# EAGLE design Wiegand (EAGLE 6.3)
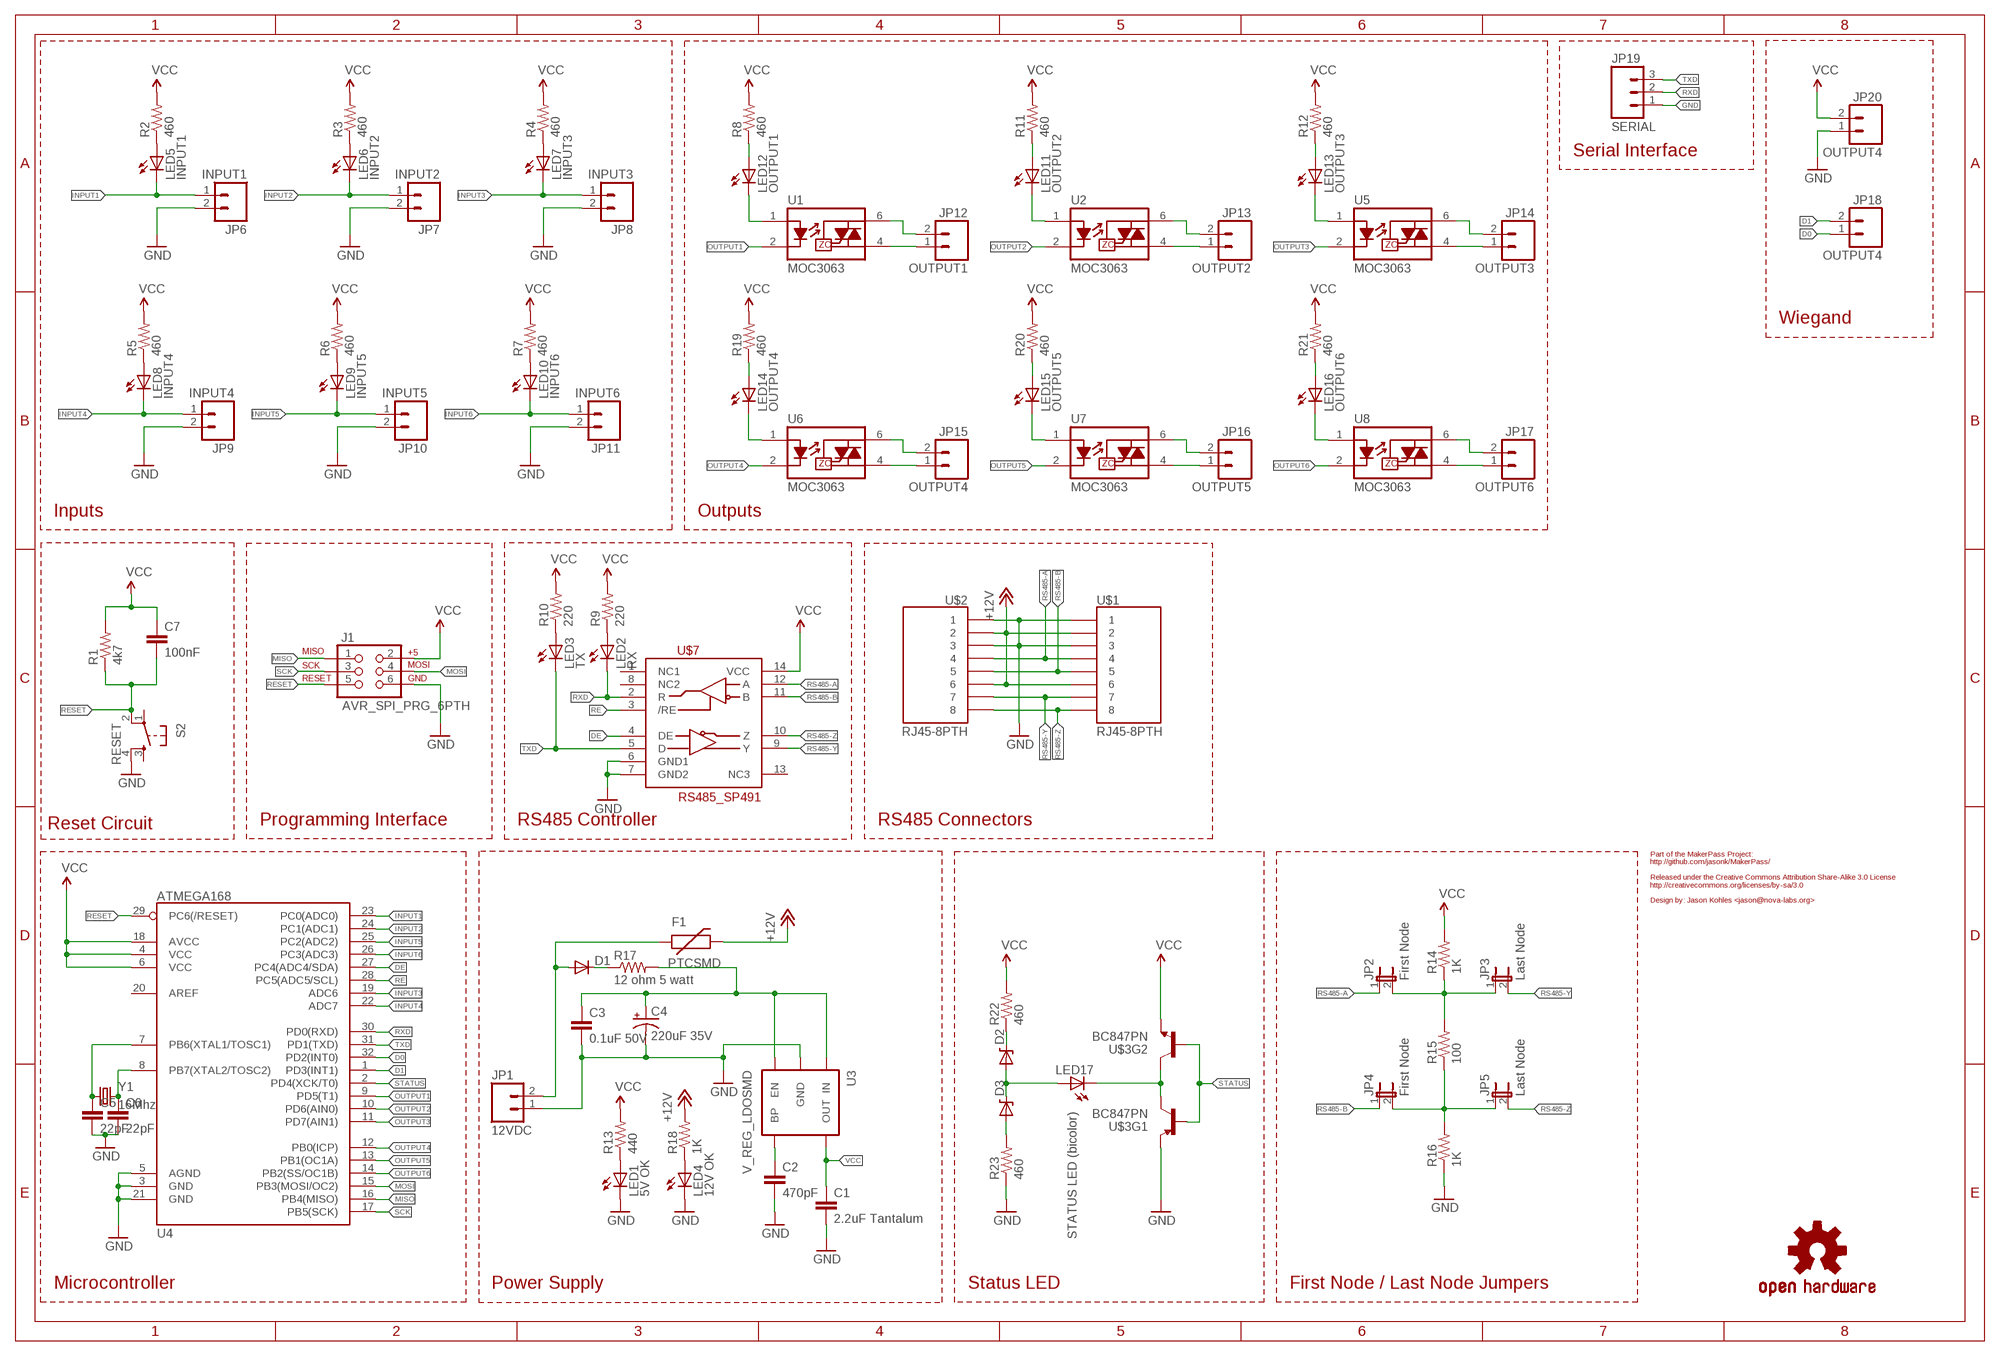
[diagram p0: schematic, sheet 1]

## Parts
C1  2.2uF Tantalum  CAP0402-CAP  [0402-CAP]
C2  470pF  CAP0402-CAP  [0402-CAP]
C3  0.1uF 50V  CAP0402-CAP  [0402-CAP]
C4  220uF 35V  CAP_POLSMD  [VISHAY_C]
C5  22pF  CAP0603-CAP  [0603-CAP]
C6  22pF  CAP0603-CAP  [0603-CAP]
C7  100nF  CAP0603-CAP  [0603-CAP]
D1  DIODESMA  [SMA-DIODE]
D2  DIODE-ZENER-BZT52  [SOD-323]
D3  DIODE-ZENER-BZT52  [SOD-323]
F1  PTCSMD  [PTC-1206]
J1  AVR_SPI_PRG_6PTH  [2X3]
JP1  12VDC  M025MM  [SCREWTERMINAL-5MM-2]
JP2  First Node  JUMPER-2PTH  [1X02]
JP3  Last Node  JUMPER-2PTH  [1X02]
JP4  First Node  JUMPER-2PTH  [1X02]
JP5  Last Node  JUMPER-2PTH  [1X02]
JP6  INPUT1  M023.5MM  [SCREWTERMINAL-3.5MM-2]
JP7  INPUT2  M023.5MM  [SCREWTERMINAL-3.5MM-2]
JP8  INPUT3  M023.5MM  [SCREWTERMINAL-3.5MM-2]
JP9  INPUT4  M023.5MM  [SCREWTERMINAL-3.5MM-2]
JP10  INPUT5  M023.5MM  [SCREWTERMINAL-3.5MM-2]
JP11  INPUT6  M023.5MM  [SCREWTERMINAL-3.5MM-2]
JP12  OUTPUT1  M023.5MM  [SCREWTERMINAL-3.5MM-2]
JP13  OUTPUT2  M023.5MM  [SCREWTERMINAL-3.5MM-2]
JP14  OUTPUT3  M023.5MM  [SCREWTERMINAL-3.5MM-2]
JP15  OUTPUT4  M023.5MM  [SCREWTERMINAL-3.5MM-2]
JP16  OUTPUT5  M023.5MM  [SCREWTERMINAL-3.5MM-2]
JP17  OUTPUT6  M023.5MM  [SCREWTERMINAL-3.5MM-2]
JP18  OUTPUT4  M023.5MM  [SCREWTERMINAL-3.5MM-2]
JP19  SERIAL  M03PTH  [1X03]
JP20  OUTPUT4  M023.5MM  [SCREWTERMINAL-3.5MM-2]
LED1  5V OK  LED1206  [LED-1206]
LED2  RX  LED1206  [LED-1206]
LED3  TX  LED1206  [LED-1206]
LED4  12V OK  LED1206  [LED-1206]
LED5  INPUT1  LED1206  [LED-1206]
LED6  INPUT2  LED1206  [LED-1206]
LED7  INPUT3  LED1206  [LED-1206]
LED8  INPUT4  LED1206  [LED-1206]
LED9  INPUT5  LED1206  [LED-1206]
LED10  INPUT6  LED1206  [LED-1206]
LED11  OUTPUT2  LED1206  [LED-1206]
LED12  OUTPUT1  LED1206  [LED-1206]
LED13  OUTPUT3  LED1206  [LED-1206]
LED14  OUTPUT4  LED1206  [LED-1206]
LED15  OUTPUT5  LED1206  [LED-1206]
LED16  OUTPUT6  LED1206  [LED-1206]
LED17  STATUS LED (bicolor)  LED1206  [LED-1206]
LOGO1  OSHW-LOGOM  [OSHW-LOGO-M]
R1  4k7  RESISTOR0603-RES  [0603-RES]
R2  460  RESISTOR0603-RES  [0603-RES]
R3  460  RESISTOR0603-RES  [0603-RES]
R4  460  RESISTOR0603-RES  [0603-RES]
R5  460  RESISTOR0603-RES  [0603-RES]
R6  460  RESISTOR0603-RES  [0603-RES]
R7  460  RESISTOR0603-RES  [0603-RES]
R8  460  RESISTOR0603-RES  [0603-RES]
R9  220  RESISTOR0603-RES  [0603-RES]
R10  220  RESISTOR0603-RES  [0603-RES]
R11  460  RESISTOR0603-RES  [0603-RES]
R12  460  RESISTOR0603-RES  [0603-RES]
R13  440  RESISTOR0603-RES  [0603-RES]
R14  1K  RESISTOR0603-RES  [0603-RES]
R15  100  RESISTOR0603-RES  [0603-RES]
R16  1K  RESISTOR0603-RES  [0603-RES]
R17  12 ohm 5 watt  RESISTOR0603-RES  [0603-RES]
R18  1K  RESISTOR0603-RES  [0603-RES]
R19  460  RESISTOR0603-RES  [0603-RES]
R20  460  RESISTOR0603-RES  [0603-RES]
R21  460  RESISTOR0603-RES  [0603-RES]
R22  460  RESISTOR0603-RES  [0603-RES]
R23  460  RESISTOR0603-RES  [0603-RES]
S2  RESET  TAC_SWITCHSMD  [TACTILE_SWITCH_SMD]
U1  MOC3063  MOC3063S  [DIP8SMD]
U2  MOC3063  MOC3063S  [DIP8SMD]
U3  V_REG_LDOSMD  [SOT23-5]
U4  ATMEGA168  [TQFP32-08]
U5  MOC3063  MOC3063S  [DIP8SMD]
U6  MOC3063  MOC3063S  [DIP8SMD]
U7  MOC3063  MOC3063S  [DIP8SMD]
U8  MOC3063  MOC3063S  [DIP8SMD]
U$1  RJ45-8PTH  [RJ45-8]
U$2  RJ45-8PTH  [RJ45-8]
U$3  BC847PN  [SOT363]
U$7  RS485_SP491  [SOIC-14]
Y1  16Mhz  CRYSTALSMD  [HC49UP]

## Nets
12V_IN [power]: D1.A F1.1 JP1.2
+12V [power]: F1.2 R18.2 U$1.2 U$1.6 U$2.2 U$2.6
D0: JP18.1 U4.32(PD2(INT0))
D1: JP18.2 U4.1(PD3(INT1))
DE: U4.27(PC4(ADC4/SDA)) U$7.4(DE)
GND: C1.2 C2.2 C3.2 C4.- C5.2 C6.2 J1.6 JP1.1 JP6.2 JP7.2 JP8.2 JP9.2 JP10.2 JP11.2 JP19.1 JP20.1 LED1.C LED4.C R16.1 R23.1 S2.4 U3.2(GND) U4.3(GND) U4.5(AGND) U4.21(GND) U$1.1 U$1.3 U$2.1 U$2.3 U$3.1(E) U$7.6(GND1) U$7.7(GND2)
INPUT1: JP6.1 LED5.C U4.23(PC0(ADC0))
INPUT2: JP7.1 LED6.C U4.24(PC1(ADC1))
INPUT3: JP8.1 LED7.C U4.19(ADC6)
INPUT4: JP9.1 LED8.C U4.22(ADC7)
INPUT5: JP10.1 LED9.C U4.25(PC2(ADC2))
INPUT6: JP11.1 LED10.C U4.26(PC3(ADC3))
MISO: J1.1 U4.16(PB4(MISO))
MOSI: J1.4 U4.15(PB3(MOSI/OC2))
N$1: LED1.A R13.1
N$3: C2.1 U3.4(BP)
N$4 [power]: C3.1 C4.+ R17.2 U3.1(IN) U3.3(EN)
N$5: LED5.A R2.1
N$6: JP4.2 JP5.1 R15.1 R16.2
N$7: JP2.2 JP3.1 R14.1 R15.2
N$8: LED4.A R18.1
N$9 [power]: D1.C R17.1
N$10: LED6.A R3.1
N$11: LED7.A R4.1
N$12: LED8.A R5.1
N$13: LED9.A R6.1
N$14: LED10.A R7.1
N$15: LED12.C U1.1(A)
N$16: LED12.A R8.1
N$17: JP12.1 U1.4(T2)
N$18: JP12.2 U1.6(T1)
N$19: JP13.1 U2.4(T2)
N$20: JP13.2 U2.6(T1)
N$21: LED11.A R11.1
N$22: LED11.C U2.1(A)
N$23: JP14.1 U5.4(T2)
N$24: JP14.2 U5.6(T1)
N$25: LED13.A R12.1
N$26: LED2.A R9.1
N$27: LED3.A R10.1
N$28: LED13.C U5.1(A)
N$29: JP15.1 U6.4(T2)
N$30: JP15.2 U6.6(T1)
N$31: LED14.A R19.1
N$32: LED14.C U6.1(A)
N$33: JP16.1 U7.4(T2)
N$34: JP16.2 U7.6(T1)
N$35: LED15.A R20.1
N$36: LED15.C U7.1(A)
N$37: JP17.1 U8.4(T2)
N$38: JP17.2 U8.6(T1)
N$39: LED16.A R21.1
N$40: LED16.C U8.1(A)
N$41: D2.1(C) R22.1
N$42: D2.2(A) D3.1(C) LED17.A
N$43: D3.2(A) R23.2
N$44: LED17.C U$3.3(C) U$3.6(C)
N$100: C5.1 U4.7(PB6(XTAL1/TOSC1)) Y1.1
N$101: C6.1 U4.8(PB7(XTAL2/TOSC2)) Y1.2
OUTPUT1: U1.2(K) U4.9(PD5(T1))
OUTPUT2: U2.2(K) U4.10(PD6(AIN0))
OUTPUT3: U4.11(PD7(AIN1)) U5.2(K)
OUTPUT4: U4.12(PB0(ICP)) U6.2(K)
OUTPUT5: U4.13(PB1(OC1A)) U7.2(K)
OUTPUT6: U4.14(PB2(SS/OC1B)) U8.2(K)
RE: U4.28(PC5(ADC5/SCL)) U$7.3(/RE)
RESET: C7.2 J1.5 R1.1 S2.2 U4.29(PC6(/RESET))
RS485-A: JP2.1 U$1.4 U$2.4 U$7.12(A)
RS485-B: JP4.1 U$1.5 U$2.5 U$7.11(B)
RS485-Y: JP3.2 U$1.7 U$2.7 U$7.9(Y)
RS485-Z: JP5.2 U$1.8 U$2.8 U$7.10(Z)
RXD: JP19.2 LED2.C U4.30(PD0(RXD)) U$7.2(R)
SCK: J1.3 U4.17(PB5(SCK))
STATUS: U4.2(PD4(XCK/T0)) U$3.2(B) U$3.5(B)
TXD: JP19.3 LED3.C U4.31(PD1(TXD)) U$7.5(D)
VCC: C1.1 C7.1 J1.2 JP20.2 R1.2 R2.2 R3.2 R4.2 R5.2 R6.2 R7.2 R8.2 R9.2 R10.2 R11.2 R12.2 R13.2 R14.2 R19.2 R20.2 R21.2 R22.2 U3.5(OUT) U4.4(VCC) U4.6(VCC) U4.18(AVCC) U$3.4(E) U$7.14(VCC)
Unconnected: S2.1 S2.3 U4.20(AREF) U$7.1(NC1) U$7.8(NC2) U$7.13(NC3)

## Notes on the sheet
- Serial Interface
- Wiegand
- Inputs | Outputs
- Reset Circuit | Programming Interface | RS485 Controller | RS485 Connectors
- Part of the MakerPass Project:
  http://github.com/jasonk/MakerPass/
  
  Released under the Creative Commons Attribution Share-Alike 3.0 License
  http://creativecommons.org/licenses/by-sa/3.0
  
  Design by: Jason Kohles <jason@nova-labs.org>
- Microcontroller | Power Supply | Status LED | First Node / Last Node Jumpers

## Library data of the parts
C1-C3 C5-C7 = SparkFun:CAP: Capacitor Standard 0603 ceramic capacitor, and 0.1" leaded capacitor.
C4 = SparkFun:CAP_POL: Capacitor Polarized These are standard SMD and PTH capacitors. Normally 10uF, 47uF, and 100uF in electrolytic and tantalum varieties. Always verify the external diameter of the through hole cap, it varies with capacity, voltage, and manufacturer. The EIA devices should be standard.
D1 = SparkFun:DIODE: Diode These are standard reverse protection diodes and small signal diodes. SMA package can handle up to about 1A. SOD-323 can handle about 200mA. What the SOD-323 package when ordering, there are some mfgs out there that are 5-pin packages.
D2 D3 = SparkFun-DiscreteSemi:DIODE-ZENER: Zener Diode Production Part - 8199 3.4V Zener Voltage
F1 = SparkFun:PTC: Resettable Fuse PTC Resettable Fuse. Spark Fun Electronics SKU : COM-08357
J1 = SparkFun:AVR_SPI_PRG_6: AVR ISP 6 Pin This is the reduced ISP connector for AVR programming. Common on Arduino. This footprint will take up less PCB space and can be used with a 10-pin to 6-pin adapter such as SKU: BOB-08508
JP1 JP6-JP18 JP20 = SparkFun:M02: Header 2 Standard 2-pin 0.1" header. Use with straight break away headers (SKU : PRT-00116), right angle break away headers (PRT-00553), swiss pins (PRT-00743), machine pins (PRT-00117), and female headers (PRT-00115). Molex polarized connector foot print use with SKU : PRT-08233 with associated crimp pins and housings.
JP2-JP5 = SparkFun:JUMPER-2: Jumper Basic 0.1" spaced jumper. Use with breakaway headers.
JP19 = SparkFun-Connectors:M03: Header 3 Standard 3-pin 0.1" header. Use with straight break away headers (SKU : PRT-00116), right angle break away headers (PRT-00553), swiss pins (PRT-00743), machine pins (PRT-00117), and female headers (PRT-00115). Molex polarized connector foot print use with SKU : PRT-08232 with associated crimp pins and housings.
LED1-LED17 = SparkFun:LED: LEDs Standard schematic elements and footprints for 5mm, 3mm, 1206, and 0603 sized LEDs. 5mm - Spark Fun Electronics SKU : COM-00529 (and others)
LOGO1 = SparkFun-Aesthetics:OSHW-LOGO: Open Source Hardware Logo This logo indicates the piece of hardware it is found on incorporates a OSHW license and/or adheres to the definition of open source hardware found here: http://freedomdefined.org/OSHW
R1-R23 = SparkFun:RESISTOR: Resistor Basic schematic elements and footprints for 0603, 1206, and PTH resistors.
S2 = SparkFun:TAC_SWITCH: Momentary Switch Button commonly used for reset or general input. Spark Fun Electronics SKU : COM-00097
U1 U2 U5-U8 = SparkFun-DiscreteSemi:MOC3063*: Optotriac in DIP and SMD LED: Vf: 1.2V If: 5 mA TRIAC Vdrm: 600V Itsm: 1A Viso: 5000V DV/dt: 1500V/us DIP: MOC3063 SMD: MOC3063S
U3 = SparkFun:V_REG_LDO: Voltage Regulator LDO Standard 150mA LDO voltage regulator in SOT-23 layout. Micrel part MIC5205. BP (by-pass) pin is used to lower output noise with 470pF cap.
U4 = SparkFun:ATMEGA168
U$1 U$2 = SparkFun:RJ45-8: RJ45 Jack Simple RJ45, 8-pin connection - connector for common Cat5, Cat5e, and Cat6 Ethernet cables. Footprint not yet proven in production. Connector sku is PRT-00643; Breakout PCB sku is BOB-00716.
U$3 = SparkFun-DiscreteSemi:BC847PN: NPN/PNP transistor pair in SOT-363 package
U$7 = SparkFun:RS485_SP491
Y1 = SparkFun:CRYSTAL: Crystals Various standard crystals. Proven footprints. Spark Fun Electronics SKU : COM-00534

## Board
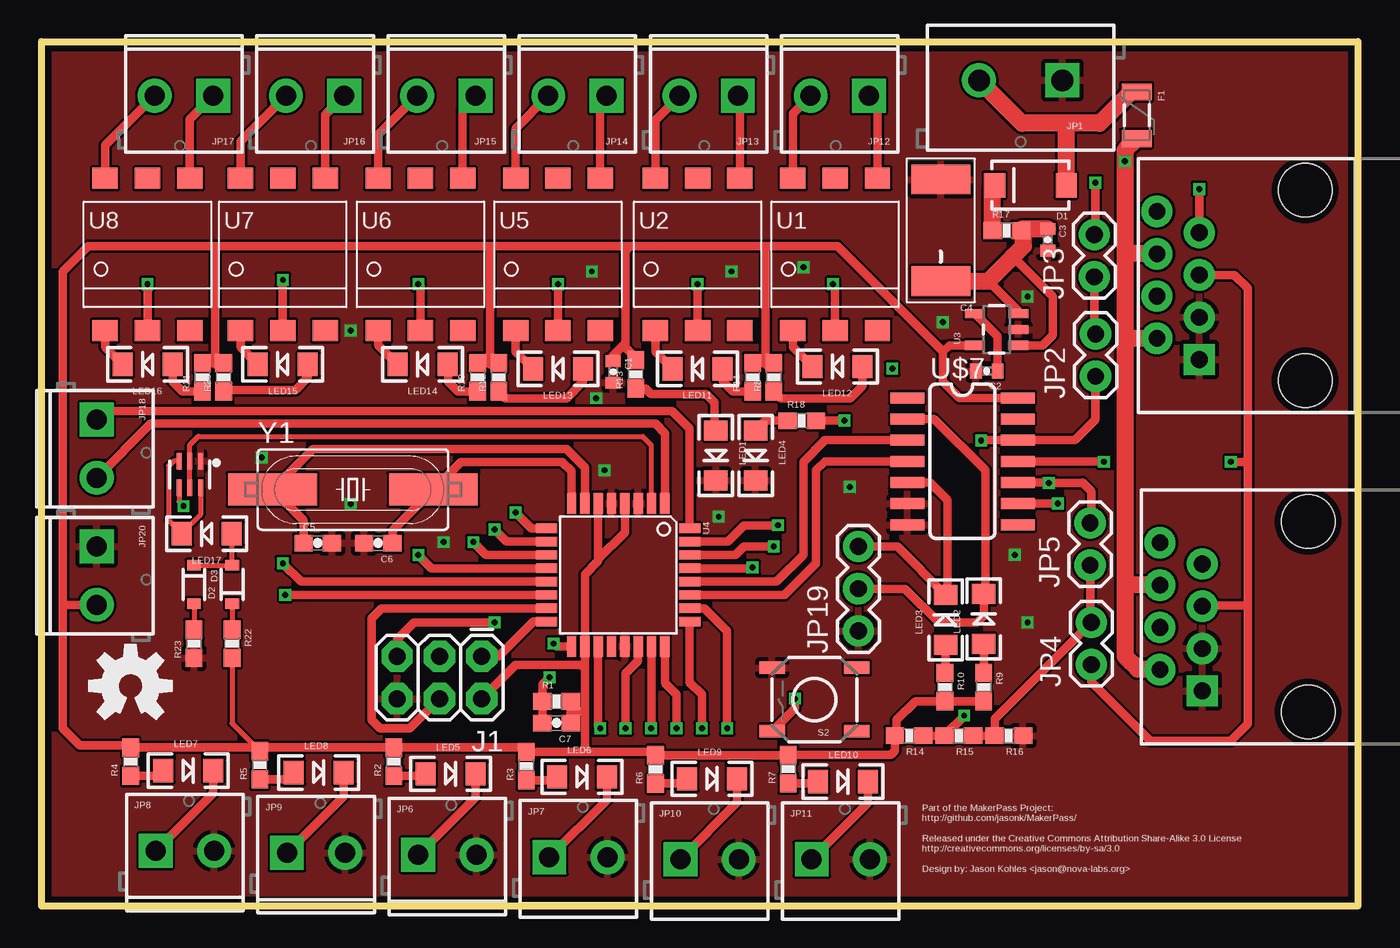
[diagram p1: board, top side]
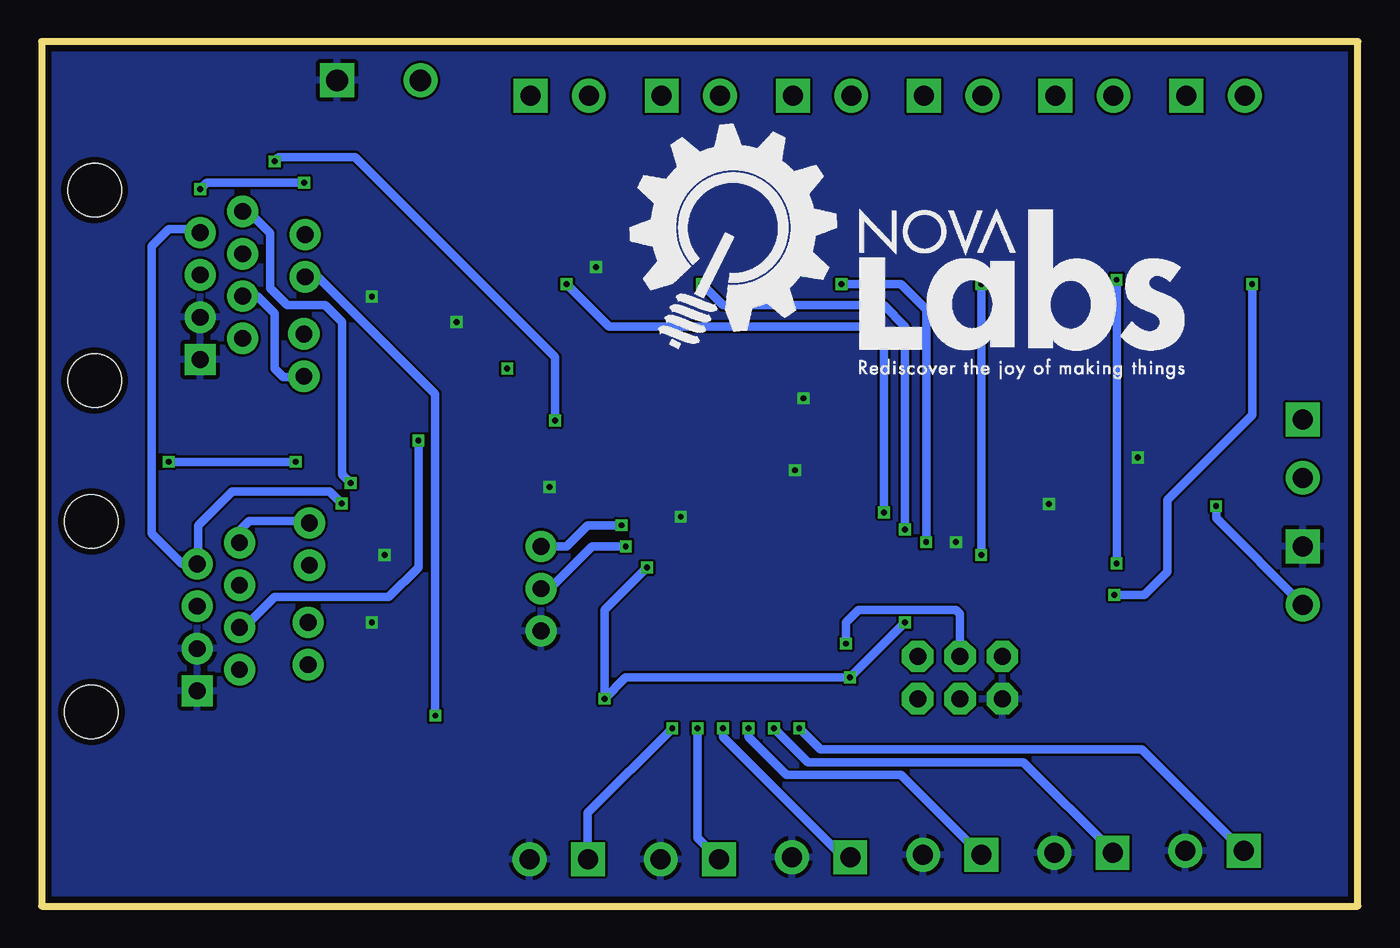
[diagram p2: board, bottom side, seen from below]

Size 79 x 51.89 mm. Coordinates in mm from the lower left corner, seen from the top.
Outline: 0,0 0,51.89 79,51.89 79,0 0,0
Copper layers (1*16): Top 0.0356mm / dielectric 1.5011mm / Bottom 0.0356mm
Design rules "OSHPark": minimum track width 6mil, minimum drill 13mil, track to track 6mil, track to pad 6mil, pad to pad 6mil, via to via 6mil, smd to smd 6mil, copper to edge 15mil, drill to drill 6mil, minimum pad ring 7mil, minimum via ring 7mil, stop-mask expansion 3mil, vias tented up to drill 0mil, thermal gap 10mil

### Footprints (pad centres in the part's own frame; a part is rotated, then mirrored left to right if it is on the bottom)
0402-CAP = smd 0.7 x 0.9: 1 -0.65,0; 2 0.65,0
VISHAY_C = smd 3.556 x 1.778: + 0,3.048; - 0,-3.048
0603-CAP = smd 1.1 x 1: 1 -0.85,0; 2 0.85,0
SMA-DIODE = smd 1.27 x 1.47: A -2.15,0; C 2.15,0
SOD-323 = smd 0.63 x 0.83: 1 -1.15,0; 2 1.15,0
PTC-1206 = smd 1 x 1.8: 1 -1.4,0; 2 1.4,0
2X3 = drill 1.016 pad 1.88 octagon: 1 0,0; 2 0,2.54; 3 2.54,0; 4 2.54,2.54; 5 5.08,0; 6 5.08,2.54
SCREWTERMINAL-5MM-2 = drill 1.3 pad 2.032 square: 1 0,0 | drill 1.3 pad 2.032: 2 5,0
1X02 = drill 1.016 pad 1.88: 1 0,0; 2 2.54,0
SCREWTERMINAL-3.5MM-2 = drill 1.2 pad 2.032 square: 1 0,0 | drill 1.2 pad 2.032: 2 3.5,0
1X03 = drill 1.016 pad 1.88: 1 0,0; 2 2.54,0; 3 5.08,0
LED-1206 = smd 1.2 x 1.4: A -1.5,0; C 1.5,0
0603-RES = smd 1.1 x 1: 1 -0.85,0; 2 0.85,0
TACTILE_SWITCH_SMD = smd 1.524 x 0.762: 1 -2.54,1.905; 2 2.54,1.905; 3 -2.54,-1.905; 4 2.54,-1.905
DIP8SMD = smd 1.524 x 1.27: 1 -2.54,-4.572; 2 0,-4.572; 3 2.54,-4.572; 4 2.54,4.572; 5 0,4.572; 6 -2.54,4.572
SOT23-5 = smd 0.55 x 1.2: 1 -0.95,-1.3; 2 0,-1.3; 3 0.95,-1.3; 4 0.95,1.3; 5 -0.95,1.3
TQFP32-08 = smd 1.27 x 0.559: 1 -4.293,2.8; 2 -4.293,2; 3 -4.293,1.2; 4 -4.293,0.4; 5 -4.293,-0.4; 6 -4.293,-1.2; 7 -4.293,-2; 8 -4.293,-2.8; 17 4.293,-2.8; 18 4.293,-2; 19 4.293,-1.2; 20 4.293,-0.4; 21 4.293,0.4; 22 4.293,1.2; 23 4.293,2; 24 4.293,2.8 | smd 0.559 x 1.27: 9 -2.8,-4.293; 10 -2,-4.293; 11 -1.2,-4.293; 12 -0.4,-4.293; 13 0.4,-4.293; 14 1.2,-4.293; 15 2,-4.293; 16 2.8,-4.293; 25 2.8,4.293; 26 2,4.293; 27 1.2,4.293; 28 0.4,4.293; 29 -0.4,4.293; 30 -1.2,4.293; 31 -2,4.293; 32 -2.8,4.293
RJ45-8 = drill 1 pad 1.88 square: 1 -4.445,6.35 | drill 1 pad 1.88: 2 -3.175,8.89; 3 -1.905,6.35; 4 -0.635,8.89; 5 0.635,6.35; 6 1.905,8.89; 7 3.175,6.35; 8 4.445,8.89 | hole 3.2: -5.715,0; 5.715,0
SOT363 = smd 0.3 x 0.99: 1 -0.65,-0.8; 2 0,-0.8; 3 0.65,-0.8; 4 0.65,0.81; 5 0,0.81; 6 -0.65,0.81
SOIC-14 = smd 0.66 x 2.032: 1 -4.445,-3.315; 2 -3.175,-3.315; 3 -1.905,-3.315; 4 -0.635,-3.315; 5 0.635,-3.315; 6 1.905,-3.315; 7 3.175,-3.315; 8 3.175,3.315; 9 1.905,3.315; 10 0.635,3.315; 11 -0.635,3.315; 12 -1.905,3.315; 13 -3.175,3.315; 14 -4.445,3.315
HC49UP = smd 5.334 x 1.93: 1 -4.826,0; 2 4.826,0

### Placement (x,y rotation side)
C1  34.31,32.06 270 top
C2  56.72,32.12 180 top
C3  60.38,40 270 top
C4  53.97,40.56 180 top
C5  16.57,21.79 0 top
C6  20.21,21.79 180 top
C7  30.91,10.99 180 top
D1  59.35,43.27 180 top
D2  11.43,19.3 90 top
D3  9.14,19.3 270 top
F1  65.73,47.47 270 top
J1  26.42,14.99 180 top
JP1  61.26,49.57 180 top
JP2  63.26,31.8 90 top
JP3  63.18,37.77 90 top
JP4  63,14.49 90 top
JP5  62.93,20.46 90 top
JP6  22.59,3.07 0 top
JP7  30.47,2.93 0 top
JP8  6.85,3.31 0 top
JP9  14.72,3.19 0 top
JP10  38.34,2.81 0 top
JP11  46.22,2.81 0 top
JP12  49.66,48.64 180 top
JP13  41.78,48.64 180 top
JP14  33.91,48.64 180 top
JP15  26.04,48.64 180 top
JP16  18.16,48.64 180 top
JP17  10.29,48.64 180 top
JP18  3.3,29.21 270 top
JP19  49.02,16.51 90 top
JP20  3.3,21.59 270 top
LED1  40.47,27.05 270 top
LED2  56.54,17.23 90 top
LED3  54.26,17.19 90 top
LED4  42.85,27.06 270 top
LED5  24.55,7.93 0 top
LED6  32.42,7.76 0 top
LED7  8.8,8.14 0 top
LED8  16.63,8.01 0 top
LED9  40.25,7.63 0 top
LED10  48.11,7.48 0 top
LED11  39.37,32.26 180 top
LED12  47.75,32.38 180 top
LED13  30.99,32.26 180 top
LED14  22.86,32.51 180 top
LED15  14.48,32.51 180 top
LED16  6.35,32.51 180 top
LED17  9.91,22.35 180 top
LOGO1  5.33,13.21 0 top
R1  30.91,12.29 0 top
R2  21.14,8.66 90 top
R3  29.09,8.41 90 top
R4  5.35,8.66 90 top
R5  13.09,8.46 90 top
R6  36.84,8.2 90 top
R7  44.81,8.22 90 top
R8  43.94,31.75 90 top
R9  56.53,13.15 270 top
R10  54.22,13.15 270 top
R11  42.67,31.75 90 top
R12  27.43,31.75 90 top
R13  35.66,31.92 90 top
R14  52.07,10.23 180 top
R15  55.06,10.23 180 top
R16  58.05,10.23 180 top
R17  57.93,40.55 0 top
R18  45.63,29.14 0 top
R19  26.16,31.75 90 top
R20  10.92,31.75 90 top
R21  9.65,31.75 90 top
R22  11.43,15.75 270 top
R23  9.14,15.75 90 top
S2  46.39,12.4 180 top
U1  47.62,39.12 0 top
U2  39.37,39.12 0 top
U3  57.32,34.61 90 top
U4  34.61,19.88 270 top
U5  30.99,39.12 0 top
U6  22.73,39.12 0 top
U7  14.48,39.12 0 top
U8  6.35,39.12 0 top
U$1  76.01,17.36 90 top
U$2  75.83,37.25 90 top
U$3  8.89,25.91 180 top
U$4  [NOVALABS]  44.2,30.73 0 bottom
U$7  55.27,26.06 270 top
Y1  18.69,25 0 top

### Tracks (layer width: path | path; a pad name or v marks a point on that pad's centre or on a via)
12V_IN
  Top 1.016: F1.1 65.38,48.87 63.5,46.99 61.21,46.99 | 61.21,46.99 58.84,46.99 JP1.2 | D1.A 61.5,46.71 61.21,46.99
+12V  (via drill 0.36 pad 0.41)
  Top 0.508: R18.2 v48.19,29.14
  Top 1.016: 65.02,38.86 v65.02,44.7 65.02,45.36 F1.2 | 65.02,38.86 65.02,34.04 | 65.02,34.04 65.02,19.05 | 65.02,19.05 65.02,14.99 65.79,14.22 67.08,14.22 U$1.2 | U$1.6 65.24,19.27 65.02,19.05 | U$2.6 65.32,39.16 65.02,38.86 | U$2.2 65.06,34.08 65.02,34.04
  Bottom 0.508: v65.02,44.7 64.77,44.96 60.2,44.96 48.19,32.95 v48.19,29.14
D0
  Top 0.508: U4.32 38.9,28.66 37.85,29.72 3.81,29.72 JP18.1
D1
  Top 0.508: U4.1 37.41,28.38 36.83,28.96 6.55,28.96 JP18.2
DE
  Top 0.508: U4.27 44.59,18.68 46.48,20.57 46.48,26.16 47.02,26.7 U$7.4
GND  (via drill 0.36 pad 0.41)
  other vias: 13.21,26.92 18.54,24.13 59.18,36.58 54.1,35.05 33.78,26.16 33.27,30.48 18.54,34.54 33.02,38.1 41.4,38.1 45.72,38.35 24.13,21.84 40.64,23.37 58.42,21.08 48.51,25.15 59.18,17.02
  pour Top: 0,0 79,0 79,51.89 0,51.89
  pour Bottom: 0,0 79,0 79,51.89 0,51.89
INPUT1  (via drill 0.36 pad 0.41)
  Top 0.508: LED5.C 26.05,6.53 JP6.1 | U4.23 36.61,10.7 v36.58,10.67
  Bottom 0.508: JP6.1 22.63,3.07 27.43,7.87 34.29,7.87 36.58,10.16 v36.58,10.67
INPUT2  (via drill 0.36 pad 0.41)
  Top 0.508: LED6.C 33.92,6.39 JP7.1 | U4.24 37.41,13.39 38.1,12.7 v38.1,10.67
  Bottom 0.508: JP7.1 30.87,2.93 38.1,10.16 v38.1,10.67
INPUT3  (via drill 0.36 pad 0.41)
  Top 0.508: U4.19 33.41,10.79 v33.53,10.67 | LED7.C 10.3,6.77 JP8.1
  Bottom 0.508: JP8.1 6.87,3.31 12.95,9.4 32.26,9.4 v33.53,10.67
INPUT4  (via drill 0.36 pad 0.41)
  Top 0.508: LED8.C 18.13,6.59 JP9.1 | U4.22 35.81,14.72 35.05,13.97 v35.05,10.67
  Bottom 0.508: JP9.1 14.72,3.29 20.07,8.64 33.02,8.64 v35.05,10.67
INPUT5  (via drill 0.36 pad 0.41)
  Top 0.508: LED9.C 41.75,6.21 JP10.1 | U4.25 38.9,13.43 39.62,12.7 v39.62,10.67
  Bottom 0.508: v39.62,10.67 39.62,4.09 JP10.1
INPUT6  (via drill 0.36 pad 0.41)
  Top 0.508: LED10.C 49.61,6.2 JP11.1 | U4.26 39.78,17.88 41.15,16.51 v41.15,10.67
  Bottom 0.508: v41.15,10.67 46.23,5.59 46.23,2.82 JP11.1
MISO
  Top 0.508: U4.16 29.52,17.08 27.43,14.99 J1.1
MOSI
  Top 0.508: U4.15 20.42,17.88 19.81,17.27 19.81,11.18 20.32,10.67 22.1,10.67 J1.4
N$1
  Top 0.508: R13.1 36.24,31.07 36.58,30.73 39.88,30.73 40.39,30.23 40.39,28.63 LED1.A
N$3
  Top 0.508: C2.1 57.37,34.21 U3.4
N$4
  Top 0.508: U3.1 60.07,33.66 60.71,34.29 60.71,36.58 58.29,38.99 | U3.3 58.62,35.71 56.82,37.51
  Top 1.016: C3.1 58.88,40.65 R17.2 58.93,40.4 58.93,39.62 58.29,38.99 56.82,37.51 C4.+
N$5
  Top 0.508: R2.1 22.93,7.81 LED5.A
N$6
  Top 0.508: JP5.1 62.93,17.1 JP4.2 57.2,11.23 R16.2 R15.1
N$7  (via drill 0.36 pad 0.41)
  Top 0.508: JP2.2 63.18,34.41 JP3.1 | R14.1 R15.2 54.21,10.27 v55.37,11.43
  Bottom 0.508: JP3.1 62.41,37.77 55.37,30.73 v55.37,11.43
N$8
  Top 0.508: R18.1 43.43,29.14 LED4.A
N$9
  Top 1.016: R17.1 57.08,43.15 D1.C
N$10
  Top 0.508: R3.1 30.72,7.56 LED6.A
N$11
  Top 0.508: R4.1 6.97,7.81 LED7.A
N$12
  Top 0.508: R5.1 14.72,7.61 LED8.A
N$13
  Top 0.508: R6.1 38.47,7.35 LED9.A
N$14
  Top 0.508: R7.1 46.5,7.37 LED10.A
N$15
  Top 0.508: U1.1 45.09,33.55 LED12.C
N$16
  Top 0.508: LED12.A 49.25,31.22 48.51,30.48 44.36,30.48 R8.1
N$17
  Top 0.508: U1.4 50.16,48.13 JP12.1
N$18
  Top 0.508: U1.6 45.09,47.57 JP12.2
N$19
  Top 0.508: U2.4 41.91,48.51 JP13.1
N$20
  Top 0.508: U2.6 36.83,47.19 JP13.2
N$21
  Top 0.508: R11.1 41.49,30.9 40.89,31.5 40.89,32.23 LED11.A
N$22
  Top 0.508: U2.1 36.83,33.3 LED11.C
N$23
  Top 0.508: U5.4 33.53,48.26 JP14.1
N$24
  Top 0.508: U5.6 28.45,46.68 JP14.2
N$25
  Top 0.508: LED13.A 32.49,31.47 31.5,30.48 27.85,30.48 R12.1
N$26
  Top 0.508: LED2.A 56.54,14.01 R9.1
N$27
  Top 0.508: 54.17,15.78 LED3.A 54.26,14.04 R10.1
N$28
  Top 0.508: U5.1 28.45,33.3 LED13.C
N$29
  Top 0.508: U6.4 25.27,47.88 JP15.1
N$30
  Top 0.508: U6.6 20.19,46.3 JP15.2
N$31
  Top 0.508: R19.1 24.98,30.9 24.38,31.5 24.38,32.49 LED14.A
N$32
  Top 0.508: U6.1 20.19,33.68 LED14.C
N$33
  Top 0.508: U7.4 17.02,47.5 JP16.1
N$34
  Top 0.508: U7.6 11.94,45.92 JP16.2
N$35
  Top 0.508: LED15.A 15.98,31.73 15.24,30.99 11.01,30.99 R20.1
N$36
  Top 0.508: U7.1 11.94,33.55 LED15.C
N$37
  Top 0.508: U8.4 8.89,47.24 JP17.1
N$38
  Top 0.508: U8.6 3.81,45.66 JP17.2
N$39
  Top 0.508: R21.1 8.47,30.9 7.87,31.5 7.87,32.49 LED16.A
N$40
  Top 0.508: U8.1 3.81,33.55 LED16.C
N$41
  Top 0.305: D2.1 R22.1
N$42
  Top 0.305: D3.1 D2.2 11.43,22.33 LED17.A
N$43
  Top 0.305: D3.2 R23.2
N$44
  Top 0.305: U$3.3 7.91,26.71 7.62,26.42 7.62,23.14 LED17.C 9.54,23.49 U$3.6
N$46  (via drill 0.36 pad 0.41)
  other vias: 51.05,32.26
N$100
  Top 0.508: U4.7 32.61,26.32 31.5,27.43 16.29,27.43 Y1.1 15.72,23.14 C5.1
N$101
  Top 0.508: 23.65,24.87 Y1.2 | U4.8 31.81,26.11 31.24,26.67 25.18,26.67 Y1.2 | C6.1 21.06,22.55 Y1.2
OUTPUT1  (via drill 0.36 pad 0.41)
  Top 0.508: U4.9 29.39,22.68 v28.45,23.62 | U1.2 47.62,37.21 v47.5,37.34
  Bottom 0.508: v28.45,23.62 28.45,34.04 29.21,34.8 44.96,34.8 v47.5,37.34
OUTPUT2  (via drill 0.36 pad 0.41)
  Top 0.508: U4.10 27.91,21.88 v27.18,22.61 | U2.2 v39.37,37.34
  Bottom 0.508: v27.18,22.61 27.18,34.8 28.45,36.07 38.1,36.07 v39.37,37.34
OUTPUT3  (via drill 0.36 pad 0.41)
  Top 0.508: U4.11 26.67,21.08 v25.91,21.84 | U5.2 v30.99,37.34
  Bottom 0.508: v30.99,37.34 27.43,37.34 25.91,35.81 v25.91,21.84
OUTPUT4  (via drill 0.36 pad 0.41)
  Top 0.508: U4.12 23.41,20.28 v22.61,21.08 | U6.2 22.73,37.21 v22.61,37.34
  Bottom 0.508: v22.61,21.08 v22.61,37.34
OUTPUT5  (via drill 0.36 pad 0.41)
  Top 0.508: U4.13 15.57,19.48 v14.48,20.57 | U7.2 v14.48,37.59
  Bottom 0.508: v14.48,20.57 v14.48,37.59
OUTPUT6  (via drill 0.36 pad 0.41)
  Top 0.508: U8.2 v6.35,37.34 | U4.14 v14.61,18.68 v14.61,18.67
  Bottom 0.508: v14.61,18.68 12.82,18.68 11.43,20.07 11.43,24.38 6.35,29.46 v6.35,37.34
RE
  Top 0.508: U$7.3 47.02,27.97 45.72,26.67 45.72,21.08 44.12,19.48 U4.28
RESET  (via drill 0.36 pad 0.41)
  Top 0.508: U4.29 42.63,20.28 v42.67,20.32 | v45.21,12.45 45.21,11.86 S2.2 | C7.2 R1.1 30.06,13.29 v30.48,13.72 | J1.5 21.34,16 22.35,17.02 v27.18,17.02
  Bottom 0.508: v42.67,20.32 45.21,17.78 v45.21,12.45 43.94,13.72 v30.48,13.72 v27.18,17.02
RS485-A  (via drill 0.36 pad 0.41)
  Top 0.508: v56.39,27.94 56.42,27.97 U$7.12 62.01,27.97 63.25,29.21 63.25,31.79 JP2.1
  Bottom 0.508: U$1.4 66.84,16.73 65.02,18.54 58.17,18.54 56.39,20.32 v56.39,27.94 | U$2.4 66.08,36.62 65.02,35.56 65.02,32.26 64.52,31.75 63.31,31.75 JP2.1
RS485-B  (via drill 0.36 pad 0.41)
  Top 0.508: JP4.1 63,13.45 66.55,9.91 71.37,9.91 72.39,10.92 72.39,18.03 | 72.39,18.03 69.7,18.03 U$1.5 | U$2.5 71.59,37.88 72.39,37.08 72.39,26.67 | 72.39,26.67 72.39,18.03 | v71.37,26.67 72.39,26.67 | U$7.11 63.73,26.7 v63.75,26.67
  Bottom 0.508: v63.75,26.67 v71.37,26.67
RS485-Y  (via drill 0.36 pad 0.41)
  Top 0.508: U$7.9 v60.99,24.16 | U$2.7 v69.48,43.04 | v63.25,43.43 63.25,40.37 JP3.2
  Bottom 0.508: U$2.7 69.69,40.64 71.37,40.64 72.39,39.62 72.39,22.35 70.57,20.54 U$1.7 69.6,20.6 69.6,22.86 67.56,24.89 61.72,24.89 v60.99,24.16 | v63.25,43.43 69.09,43.43 v69.48,43.04
RS485-Z  (via drill 0.36 pad 0.41)
  Top 0.508: JP5.2 62.99,23.06 62.99,24.89 62.45,25.43 62.43,25.4 v60.45,25.4 60.42,25.43 U$7.10
  Bottom 0.508: U$1.8 67.12,22.54 66.55,23.11 63.05,23.11 JP5.2 | U$2.8 66.59,41.7 65.28,40.39 65.28,37.08 64.26,36.07 61.98,36.07 60.96,35.05 60.96,25.91 v60.45,25.4
RXD  (via drill 0.36 pad 0.41)
  Top 0.508: U$7.2 53.56,29.24 56.64,26.16 56.64,18.82 LED2.C 56.54,17.43 56.13,17.02 53.85,17.02 51.82,19.05 JP19.2 | U4.30 41.65,21.08 42.16,21.59 v43.94,21.59
  Bottom 0.508: JP19.2 48.51,19.05 45.97,21.59 v43.94,21.59
SCK  (via drill 0.36 pad 0.41)
  Top 0.508: U4.17 30.9,15.59 v30.73,15.75
  Bottom 0.508: v30.73,15.75 30.73,17.02 29.97,17.78 24.13,17.78 23.88,17.53 J1.3
STATUS
  Top 0.305: U$3.2 U$3.5 8.89,27.69 9.4,28.19 36.07,28.19 36.58,27.69 36.58,24.2 U4.2
TXD  (via drill 0.36 pad 0.41)
  Top 0.508: U$7.5 53.31,25.43 54.36,24.38 54.36,18.79 LED3.C 51.36,21.59 JP19.3 | U4.31 41.18,21.88 42.16,22.86 v44.2,22.86
  Bottom 0.508: JP19.3 47.5,21.59 46.23,22.86 v44.2,22.86
VCC  (via drill 0.36 pad 0.41)
  Top 0.305: R22.2 11.43,10.97 R5.2 | U$3.4 8.24,24.27 v8.51,24
  Top 0.508: 12.89,9.51 R4.2 5.21,9.65 2.29,9.65 1.27,10.67 1.27,18.03 | 12.89,9.51 R5.2 | 12.89,9.51 R2.2 28.84,9.51 R3.2 32.51,9.26 | 32.51,9.26 36.64,9.26 R6.2 44.8,9.05 R7.2 50.98,9.07 51.22,9.31 R14.2 51.31,10.32 51.31,11.18 52.43,12.3 R9.2 R10.2 | 32.61,14.22 U4.18 32.61,19.91 33.41,20.71 33.41,20.83 | 32.61,14.22 32.61,11.68 | 32.61,11.68 32.61,9.35 32.51,9.26 | 10.41,39.62 2.79,39.62 1.27,38.1 1.27,18.03 | 10.41,39.62 26.92,39.62 | 26.92,39.62 35.31,39.62 | 35.31,39.62 43.43,39.62 | R21.2 10.33,32.6 10.41,32.51 10.41,32.77 | 10.41,32.77 10.41,39.62 | R20.2 10.58,32.6 10.41,32.77 | R19.2 26.84,32.6 26.92,32.51 26.92,32.77 | 26.92,32.77 26.92,39.62 | R12.2 27.09,32.6 26.92,32.77 | R11.2 R8.2 43.52,32.6 43.43,32.51 43.43,39.62 | 35.31,39.62 35.01,39.32 35.05,39.28 35.05,33.78 | U$7.14 55.09,30.51 54.1,31.5 54.1,33.27 | U3.5 54.49,33.66 54.1,33.27 | U4.6 33.41,20.83 | R1.2 C7.1 31.76,11.68 31.75,11.68 32.61,11.68 | J1.2 28.45,14.48 32.35,14.48 32.61,14.22 | 54.1,33.27 47.75,39.62 43.43,39.62 | U4.4 35.01,22.43 33.41,20.83 | R13.2 35.66,32.92 35.05,33.53 35.05,33.78 | C1.1 34.31,33.04 35.05,33.78 | JP20.2 1.33,18.09 1.27,18.03
  Bottom 0.508: v8.51,24 8.51,23.3 JP20.2

### Text on the board
tNames: Part of the MakerPass Project: / http://github.com/jasonk/MakerPass/ / / Released under the Creative Commons Attribution Share-Alike 3.0 License / http://creativecommons.org/licenses/by-sa/3.0 / / Design by: Jason Kohles <jason@nova-labs.org>